# Altium schematic sheet 12V_Buck_For_Rest.SchDoc
size 259 x 167 mm; SheetNumber: 4; SheetTotal: 15
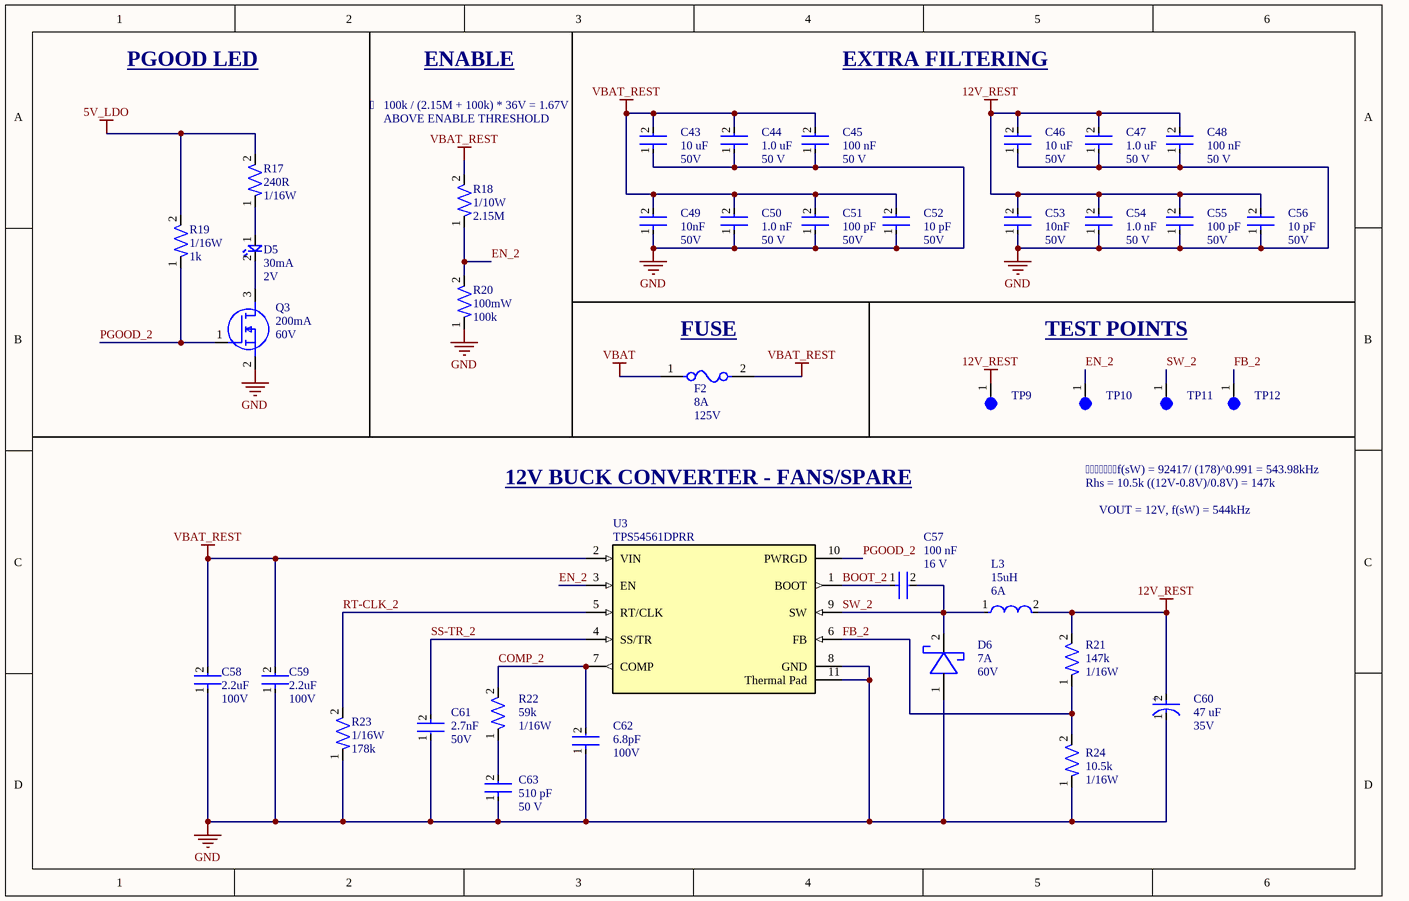
[diagram p0: 12V_Buck_For_Rest.SchDoc]

## Parts
C43  Voltage: 50V  Capacitance: 10 uF  [CAP-1210]  (hidden comment: CL32B106KBJNNNE)
C44  Voltage: 50 V  Capacitance: 1.0 uF  [CAP-0805]  (hidden comment: CC0805KKX7R9BB105)
C45  Voltage Rating: 50 V  Capacitance: 100 nF  [CAP-0805]  (hidden comment: CC0805KRX7R9BB104)
C46  Voltage: 50V  Capacitance: 10 uF  [CAP-1210]  (hidden comment: CL32B106KBJNNNE)
C47  Voltage: 50 V  Capacitance: 1.0 uF  [CAP-0805]  (hidden comment: CC0805KKX7R9BB105)
C48  Voltage Rating: 50 V  Capacitance: 100 nF  [CAP-0805]  (hidden comment: CC0805KRX7R9BB104)
C49  Voltage: 50V  Capacitance: 10nF  [CAP-0805]  (hidden comment: GRM2195C1H103JA01D)
C50  Voltage: 50 V  Capacitance: 1.0 nF  [CAP-0402]  (hidden comment: CC0402KRX7R9BB102)
C51  Capacitance: 100 pF  Voltage: 50V  [CAP-0402]  (hidden comment: CC0402JRNPO9BN101)
C52  Capacitance: 10 pF  Voltage: 50V  [CAP-0402]  (hidden comment: CC0402JRNPO9BN100)
C53  Voltage: 50V  Capacitance: 10nF  [CAP-0805]  (hidden comment: GRM2195C1H103JA01D)
C54  Voltage: 50 V  Capacitance: 1.0 nF  [CAP-0402]  (hidden comment: CC0402KRX7R9BB102)
C55  Capacitance: 100 pF  Voltage: 50V  [CAP-0402]  (hidden comment: CC0402JRNPO9BN101)
C56  Capacitance: 10 pF  Voltage: 50V  [CAP-0402]  (hidden comment: CC0402JRNPO9BN100)
C57  Voltage Rating: 16 V  Capacitance: 100 nF  [CAP-0402]  (hidden comment: CC0402KRX7R7BB104)
C58  Capacitance: 2.2uF  Voltage: 100V  [CAP-1206]  (hidden comment: CC1206KKX7R0BB225)
C59  Capacitance: 2.2uF  Voltage: 100V  [CAP-1206]  (hidden comment: CC1206KKX7R0BB225)
C60  Voltage: 35V  Capacitance: 47 uF  [CAP_EEHZC1V470P]  (hidden comment: EEH-ZC1V470P)
C61  Voltage: 50V  Capacitance: 2.7nF  [CAP-0805]  (hidden comment: GRM2165C1H272JA01D)
C62  Voltage: 100V  Capacitance: 6.8pF  [CAP-0603]  (hidden comment: CC0603CRNPO0BN6R8)
C63  Voltage: 50 V  Capacitance: 510 pF  [CAP-0402]  (hidden comment: 0402N511J500CT)
D5  Forward Current: 30mA  Forward Voltage: 2V  [LED-0603]  (hidden comment: BL-HKC36G-AV-TRB)
D6  Forward Current: 7A  Reverse Voltage (DC): 60V  [DO-POWERDI5]  (hidden comment: PDS760-13)
F2  Fuse Current: 8A  Voltage Rating: 125V  [FUSE-0001]  (hidden comment: 01550900M)
L3  Inductance: 15uH  Current Rating: 6A  [IND-15U-0002]  (hidden comment: CSAD1010-150M)
Q3  Continuous Current: 200mA  Voltage: 60V  [IC-SOT23-3]  (hidden comment: T2N7002AK,LM)
R17  Resistance: 240R  Power: 1/16W  [RES-0402]  (hidden comment: RC0402FR-07240RL)
R18  Power: 1/10W  Resistance: 2.15M  [RES-0603]  (hidden comment: RC0603FR-072M15L)
R19  Power: 1/16W  Resistance: 1k  [RES-0402]  (hidden comment: RC0402FR-071KL)
R20  Power: 100mW  Resistance: 100k  [RES-0603]  (hidden comment: RC0603FR-07100KL)
R21  Power: 1/16W  Resistance: 147k  [RES-0402]  (hidden comment: RC0402FR-07147KL)
R22  Power: 1/16W  Resistance: 59k  [RES-0402]  (hidden comment: RC0402FR-0759KL)
R23  Power: 1/16W  Resistance: 178k  [RES-0402]  (hidden comment: RTT021783FTH)
R24  Power: 1/16W  Resistance: 10.5k  [RES-0402]  (hidden comment: RC0402FR-0710K5L)
TP9  5003  [TEST-POINT-0001]  (value not drawn)
TP10  5003  [TEST-POINT-0001]  (value not drawn)
TP11  5003  [TEST-POINT-0001]  (value not drawn)
TP12  5003  [TEST-POINT-0001]  (value not drawn)
U3  TPS54561DPRR  [IC-10WSON]

## Nets
5V_LDO: R17.2 R19.2
12V_REST: C46.2 C47.2 C48.2 C53.2 C54.2 C55.2 C56.2 C60.2(A) L3.2 R21.2 TP9.1
GND: C43.1 C44.1 C45.1 C46.1 C47.1 C48.1 C49.1 C50.1 C51.1 C52.1 C53.1 C54.1 C55.1 C56.1 C58.1 C59.1 C60.1(C) C61.1 C62.1 C63.1 D6.1(CATHODE) Q3.2(S) R20.1 R23.1 R24.1 U3.8(GND) U3.11(Thermal_Pad)
VBAT: F2.1
VBAT_REST: C43.2 C44.2 C45.2 C49.2 C50.2 C51.2 C52.2 C58.2 C59.2 F2.2 R18.2 U3.2(VIN)
BOOT_2: C57.1 U3.1(BOOT)
COMP_2: C62.2 R22.2 U3.7(COMP)
EN_2: R18.1 R20.2 TP10.1 U3.3(EN)
FB_2: R21.1 R24.2 TP12.1 U3.6(FB)
PGOOD_2: Q3.1(G) R19.1 U3.10(PWRGD)
RT-CLK_2: R23.2 U3.5(RT/CLK)
SS-TR_2: C61.2 U3.4(SS/TR)
SW_2: C57.2 D6.2(ANODE) L3.1 TP11.1 U3.9(SW)
NetC63_2: C63.2 R22.1
NetD5_1: D5.1 R17.1
NetD5_2: D5.2 Q3.3(D)

## Notes on the sheet
- PGOOD LED
- 
- 100k / (2.15M + 100k) * 36V = 1.67V
- ENABLE
- EXTRA FILTERING
- ABOVE ENABLE THRESHOLD
- (near F2) FUSE
- TEST POINTS
- 12V BUCK CONVERTER - FANS/SPARE
- Rhs = 10.5k ((12V-0.8V)/0.8V) = 147k
- f(sW) = 92417/ (178)^0.991 = 543.98kHz
- VOUT = 12V, f(sW) = 544kHz
- (in symbol CAP-47U-0003) +

## Library data of the parts
C43 C46 = CAP-10U-0002: CAP CER 10UF 50V X7R 1210; Device Class: Ceramic; Size: 1210; ComponentLink1Description: Datasheet; ComponentLink1URL: https://mm.digikey.com/Volume0/opasdata/d220001/medias/docus/41/CL32B106KBJNNNE_Spec.pdf
C44 C47 = CAP-1U-0001: CAP CER 1UF 50V X7R 0805; ComponentLink2URL: https://www.yageo.com/upload/media/product/productsearch/datasheet/mlcc/UPY-GPHC_X7R_6.3V-to-250V_24.pdf; ComponentLink2Description: Datasheet; Device Class: Ceramic; Size: 0805
C45 C48 = CAP-0.1U-0002: CAP CER 0.1UF 50V X7R 0805; ComponentLink2Description: Datasheet; ComponentLink2URL: https://www.yageo.com/upload/media/product/productsearch/datasheet/mlcc/UPY-GPHC_X7R_6.3V-to-250V_24.pdf; Device Class: Ceramic; Size: 0805
C49 C53 = CAP-10N-0001: CAP CER 10000PF 50V C0G/NP0 0805; Device Class: Ceramic; Size: 0805; ComponentLink1Description: Datasheet; ComponentLink1URL: https://search.murata.co.jp/Ceramy/image/img/A01X/G101/ENG/GRM2195C1H103JA01-01.pdf
C50 C54 = CAP-1N-0001: CAP CER 1000PF 50V X7R 0402; ComponentLink2Description: Datasheet; ComponentLink2URL: http://www.yageo.com/documents/recent/UPY-GP_NP0_16V-to-50V_16.pdf; Device Class: Ceramic; Size: 0402
C51 C55 = CAP-100P-0001: CAP CER 100PF 50V C0G/NPO 0402; Device Class: Ceramic; Size: 0402; ComponentLink1Description: Datasheet; ComponentLink1URL: https://www.yageo.com/upload/media/product/productsearch/datasheet/mlcc/UPY-GP_NP0_16V-to-50V_18.pdf
C52 C56 = CAP-10P-0001: CAP CER 10PF 50V C0G/NPO 0402; Device Class: Ceramic; Size: 0402; ComponentLink1Description: Datasheet; ComponentLink1URL: https://www.yageo.com/upload/media/product/productsearch/datasheet/mlcc/UPY-GP_NP0_16V-to-50V_18.pdf
C57 = CAP-0.1U-0001: CAP CER 0.1UF 16V X7R 0402; ComponentLink2Description: Datasheet; ComponentLink2URL: https://www.yageo.com/upload/media/product/productsearch/datasheet/mlcc/UPY-GPHC_X7R_6.3V-to-250V_24.pdf; Device Class: Ceramic; Size: 0402
C58 C59 = CAP-2.2U-0001: CAP CER 2.2UF 100V X7R 1206; Device Class: Ceramic; Size: 1206; ComponentLink1Description: Datasheet; ComponentLink1URL: https://www.yageo.com/upload/media/product/productsearch/datasheet/mlcc/UPY-GPHC_X7R_6.3V-to-250V_24.pdf
C60 = CAP-47U-0003: 47 µF 35 V Aluminum - Polymer Capacitors Radial, Can - SMD 60mOhm 4000 Hrs @ 125°C; Device Class: Electrolytic
C61 = CAP-2.7N-0001: CAP CER 2700PF 50V C0G/NP0 0805; ComponentLink1Description: Datasheet; ComponentLink1URL: https://search.murata.co.jp/Ceramy/image/img/A01X/G101/ENG/GRM2165C1H272JA01-01.pdf; Device Class: Ceramic; Size: 0805
C62 = CAP-6.8P-0001: CAP CER 6.8PF 100V C0G/NPO 0603; Device Class: Ceramic; ComponentLink1Description: Datasheet; ComponentLink1URL: https://www.yageo.com/upload/media/product/productsearch/datasheet/mlcc/UPY-GPHC_X7R_6.3V-to-250V_24.pdf; Size: 0603
C63 = CAP-510P-0001: CAP CER 510PF 50V C0G/NP0 0402; ComponentLink2Description: Datasheet; ComponentLink2URL: https://www.mouser.com/ProductDetail/Walsin/0402N511J500CT?qs=u16ybLDytRbq33ukPPRl4A%3D%3D&srsltid=AfmBOoq1-HCbTRqPV3GtwyI6lHLBf095DSA3Qg1Qkiix4a-obr82TmJ6; Device Class: Ceramic; Size: 0402
D5 = LED-0001: LED YELLOW CLEAR 0603 SMD; ComponentLink1Description: Datasheet; ComponentLink1URL: https://www.americanbrightled.com/pdffiles/led-components/smt/BL-HKC36G-AV-TRB.pdf
D6 = DIO-SCHOTTKY-0001: DIODE SCHOTTKY 60V 7A POWERDI5; ComponentLink1Description: Datasheet; ComponentLink1URL: https://www.diodes.com/assets/Datasheets/PDS760.pdf
F2 = FUSE-0001: FUSE BLOK CARTRIDGE 125V 10A SMD; ComponentLink2Description: Datasheet; ComponentLink2URL: https://www.littelfuse.com/~/media/electronics/datasheets/fuses/littelfuse_fuse_154_154t_154l_154tl_datasheet.pdf.pdf
L3 = IND-15U-0002-NoJLC: SMD MOLDING POWER CHOKE; ComponentLink1Description: Datasheet; ComponentLink1URL: https://www.digikey.com/en/products/detail/codaca/CSAD1010-150M/16633512?s=N4IgjCBcoBwAxVAYygMwIYBsDOBTANCAPZQDaIALHAExwDMEAuoQA4AuUIAymwE4CWAOwDmIAL6Ew1MAE5EIFJAw4CxMiGoy6AdmoUQhajGqa6BjTDp6zhywFY4c23UtOLFbVXPVtYK3e9dODsbdwA2OxgQZhB2Th4BEXFJTQhoBTQsPEISSHITS0do1g5Ibj4hUQkNOBhteTiygFVBfjYAeVQAWVx0bABXXlxzfs4AVoAJcwBbIU4wAMJp9AAPeYDq2hgo9MaQFrbOnr7B4cJRsoBBGbmyuwA6DcIAWmp5RT5%2B1VzyAMYxAFAA
Q3 = NMOS-200MA-0001: MOSFET N-CH 60V 200MA SOT23; ComponentLink1Description: Datasheet; ComponentLink1URL: https://toshiba.semicon-storage.com/info/T2N7002AK_datasheet_en_20150401.pdf?did=29712&prodName=T2N7002AK
R17 = RES-240-0001: 240R 0.063W 1% 0402 (1005 Metric)  SMD; Tolerance: 1%; Size: 0402; ComponentLink1Description: Datasheet; ComponentLink1URL: https://www.yageo.com/upload/media/product/products/datasheet/rchip/PYu-RC_Group_51_RoHS_L_12.pdf
R18 = RES-2.15M-0001: RES SMD 2.15M OHM 1% 1/10W 0603; Tolerance: 1%; Size: 0603; ComponentLink1Description: Datasheet; ComponentLink1URL: https://www.yageo.com/upload/media/product/products/datasheet/rchip/PYu-RC_Group_51_RoHS_L_12.pdf
R19 = RES-1k-0001: RES 1K OHM 1% 1/16W 0402; Tolerance: 1%; Size: 0402; ComponentLink1Description: Datasheet; ComponentLink1URL: https://www.yageo.com/upload/media/product/products/datasheet/rchip/PYu-RC_Group_51_RoHS_L_12.pdf
R20 = RES-100k-0001: RES SMD 100K OHM 1% 1/10W 0603; Tolerance: 1%; Size: 0603; ComponentLink1Description: Datasheet; ComponentLink1URL: https://www.yageo.com/upload/media/product/products/datasheet/rchip/PYu-RC_Group_51_RoHS_L_12.pdf
R21 = RES-147k-0001: RES 147K OHM 1% 1/16W 0402; Tolerance: 1%; Size: 0402; ComponentLink1Description: Datasheet; ComponentLink1URL: https://www.yageo.com/upload/media/product/products/datasheet/rchip/PYu-RC_Group_51_RoHS_L_12.pdf
R22 = RES-59k-0001: RES 59K OHM 1% 1/16W 0402; Tolerance: 1%; Size: 0402; ComponentLink1Description: Datasheet; ComponentLink1URL: https://www.digikey.com/en/products/detail/yageo/RC0402FR-0759KL/2827634?s=N4IgTCBcDaIEoGEAMAWJYBicC0SDsArAJwDSAMiALoC%2BQA
R23 = RES-178k-0001_1: 62.5mW Thick Film Resistors 50V ±100ppm/℃ ±1% 178kΩ 0402 Chip Resistor - Surface Mount ROHS; Tolerance: 1%; Size: 0402; ComponentLink1Description: Datasheet; ComponentLink1URL: https://www.lcsc.com/datasheet/lcsc_datasheet_2304140030_RALEC-RTT021783FTH_C102842.pdf
R24 = RES-10.5k-0001: RES 10.5K OHM 1% 1/16W 0402; Tolerance: 1%; Size: 0402; ComponentLink1Description: Datasheet; ComponentLink1URL: https://www.yageo.com/upload/media/product/products/datasheet/rchip/PYu-RC_Group_51_RoHS_L_12.pdf
TP9-TP12 = TEST-POINT-0001: Oranange PC Test Point, Miniature Phoisphor Bronze Silver Plating Through Hole Mounting Type
U3 = IC-BUCK-0001: IC REG BUCK ADJ 5A 10WSON; ComponentLink1Description: Datasheet; ComponentLink1URL: https://www.ti.com/general/docs/suppproductinfo.tsp?distId=10&gotoUrl=https%3A%2F%2Fwww.ti.com%2Flit%2Fgpn%2Ftps54561